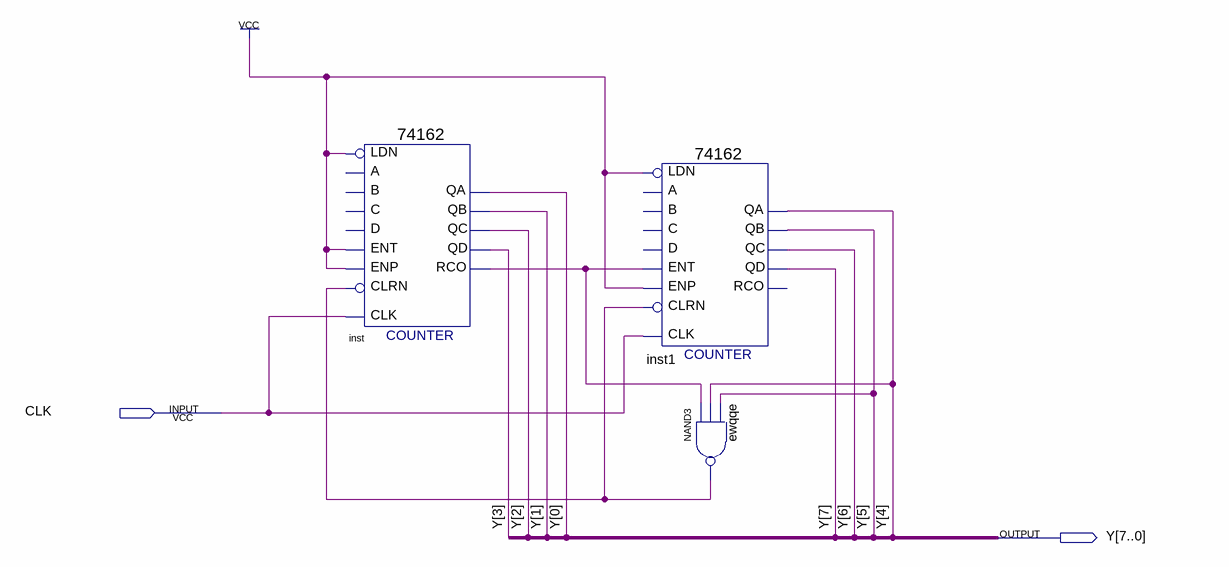
[diagram p0: schematic sheet]
// Quartus schematic Mod64Counter.bdf as structural Verilog: 3 symbols, 2 pins
module Mod64Counter (
  input  CLK,
  output [7:0] Y
);

  wire ewqqe_out, inst_rco;

  \74162  inst (
    .LDN(1'b1), .ENP(1'b1), .ENT(1'b1), .CLRN(ewqqe_out), .CLK(CLK), .QA(Y[0]), .QB(Y[1]), .QC(Y[2]),
    .QD(Y[3]), .RCO(inst_rco));  // open: A, B, C, D
  \74162  inst1 (
    .LDN(1'b1), .ENP(1'b1), .ENT(inst_rco), .CLRN(ewqqe_out), .CLK(CLK), .QA(Y[4]), .QB(Y[5]), .QC(Y[6]),
    .QD(Y[7]));  // open: A, B, C, D, RCO
  nand ewqqe (ewqqe_out, inst_rco, Y[4], Y[5]);
endmodule
